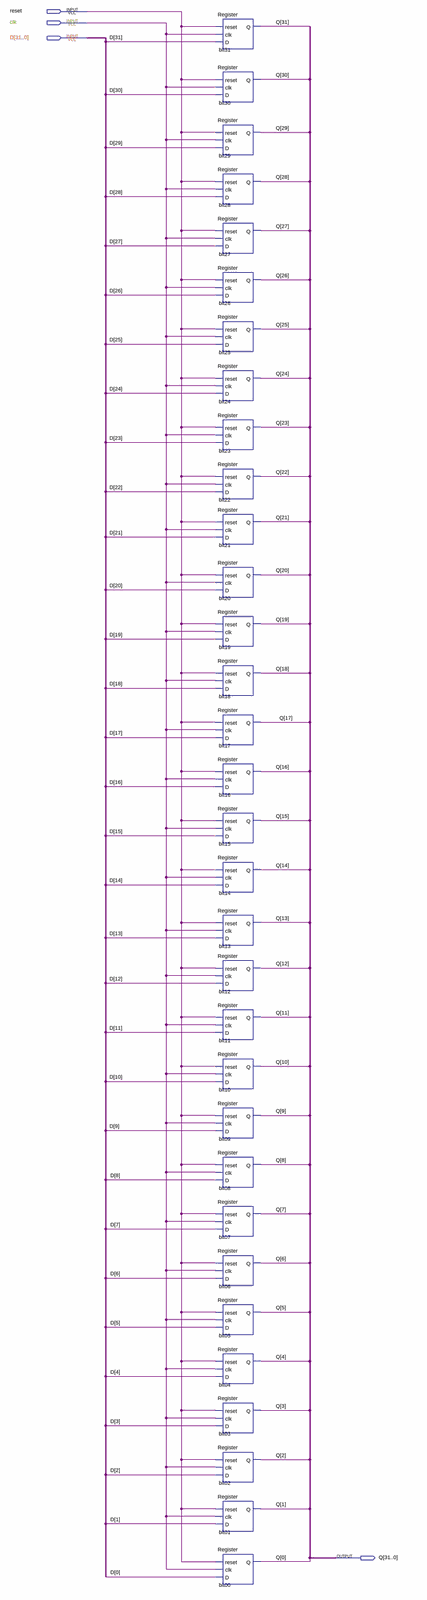
[diagram p0: schematic sheet, whole]
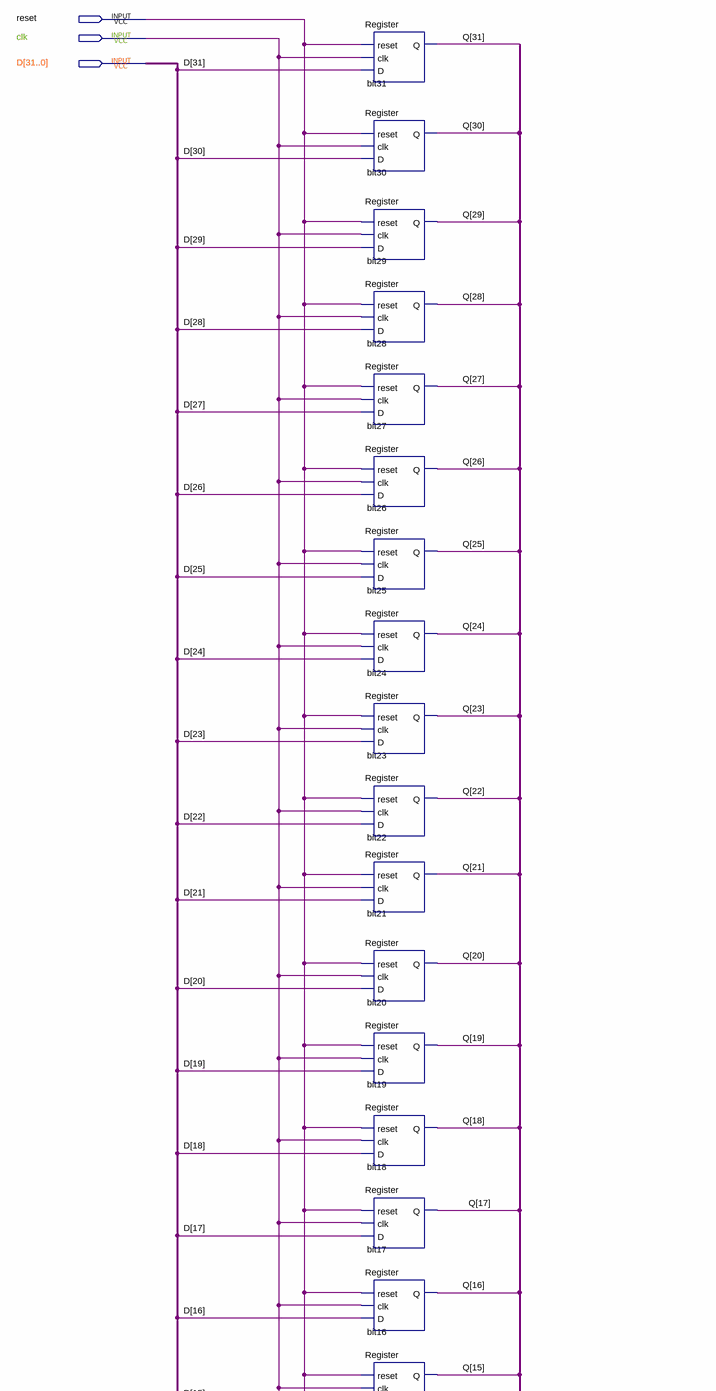
[diagram p1: schematic sheet, upper part]
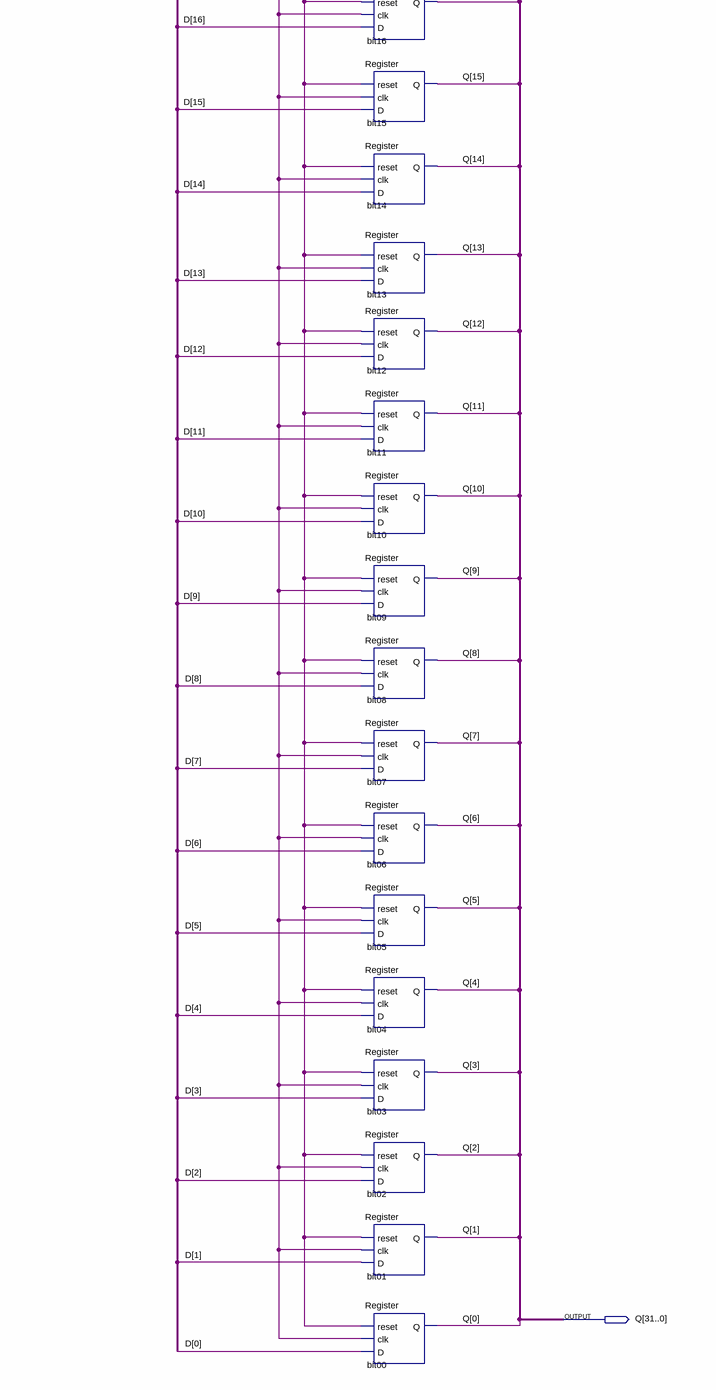
[diagram p2: schematic sheet, lower part]
// Quartus schematic Register_32.bdf as structural Verilog: 32 symbols, 4 pins
module Register_32 (
  input  reset,
  input  clk,
  input  [31:0] D,
  output [31:0] Q
);

  Register bit31 (.reset(reset), .clk(clk), .D(D[31]), .Q(Q[31]));
  Register bit30 (.reset(reset), .clk(clk), .D(D[30]), .Q(Q[30]));
  Register bit29 (.reset(reset), .clk(clk), .D(D[29]), .Q(Q[29]));
  Register bit28 (.reset(reset), .clk(clk), .D(D[28]), .Q(Q[28]));
  Register bit27 (.reset(reset), .clk(clk), .D(D[27]), .Q(Q[27]));
  Register bit26 (.reset(reset), .clk(clk), .D(D[26]), .Q(Q[26]));
  Register bit25 (.reset(reset), .clk(clk), .D(D[25]), .Q(Q[25]));
  Register bit24 (.reset(reset), .clk(clk), .D(D[24]), .Q(Q[24]));
  Register bit23 (.reset(reset), .clk(clk), .D(D[23]), .Q(Q[23]));
  Register bit22 (.reset(reset), .clk(clk), .D(D[22]), .Q(Q[22]));
  Register bit21 (.reset(reset), .clk(clk), .D(D[21]), .Q(Q[21]));
  Register bit20 (.reset(reset), .clk(clk), .D(D[20]), .Q(Q[20]));
  Register bit19 (.reset(reset), .clk(clk), .D(D[19]), .Q(Q[19]));
  Register bit18 (.reset(reset), .clk(clk), .D(D[18]), .Q(Q[18]));
  Register bit17 (.reset(reset), .clk(clk), .D(D[17]), .Q(Q[17]));
  Register bit16 (.reset(reset), .clk(clk), .D(D[16]), .Q(Q[16]));
  Register bit15 (.reset(reset), .clk(clk), .D(D[15]), .Q(Q[15]));
  Register bit14 (.reset(reset), .clk(clk), .D(D[14]), .Q(Q[14]));
  Register bit13 (.reset(reset), .clk(clk), .D(D[13]), .Q(Q[13]));
  Register bit12 (.reset(reset), .clk(clk), .D(D[12]), .Q(Q[12]));
  Register bit11 (.reset(reset), .clk(clk), .D(D[11]), .Q(Q[11]));
  Register bit10 (.reset(reset), .clk(clk), .D(D[10]), .Q(Q[10]));
  Register bit09 (.reset(reset), .clk(clk), .D(D[9]), .Q(Q[9]));
  Register bit08 (.reset(reset), .clk(clk), .D(D[8]), .Q(Q[8]));
  Register bit07 (.reset(reset), .clk(clk), .D(D[7]), .Q(Q[7]));
  Register bit06 (.reset(reset), .clk(clk), .D(D[6]), .Q(Q[6]));
  Register bit05 (.reset(reset), .clk(clk), .D(D[5]), .Q(Q[5]));
  Register bit04 (.reset(reset), .clk(clk), .D(D[4]), .Q(Q[4]));
  Register bit03 (.reset(reset), .clk(clk), .D(D[3]), .Q(Q[3]));
  Register bit02 (.reset(reset), .clk(clk), .D(D[2]), .Q(Q[2]));
  Register bit01 (.reset(reset), .clk(clk), .D(D[1]), .Q(Q[1]));
  Register bit00 (.reset(reset), .clk(clk), .D(D[0]), .Q(Q[0]));
endmodule
